# Altium schematic sheet T-Type_Board.SchDoc: <Document>
size Letter; Engineer: <Engineer>; Organization: UPEL; Address1: USU Power Electronics Lab; Address2: USTAR Building 620, RM 118; Address3: 1600 N 620 E; Address4: North Logan, UT 84341; DocumentNumber: 10; Revision: v1; SheetNumber: 10; SheetTotal: 16; ProjectName: <Project>
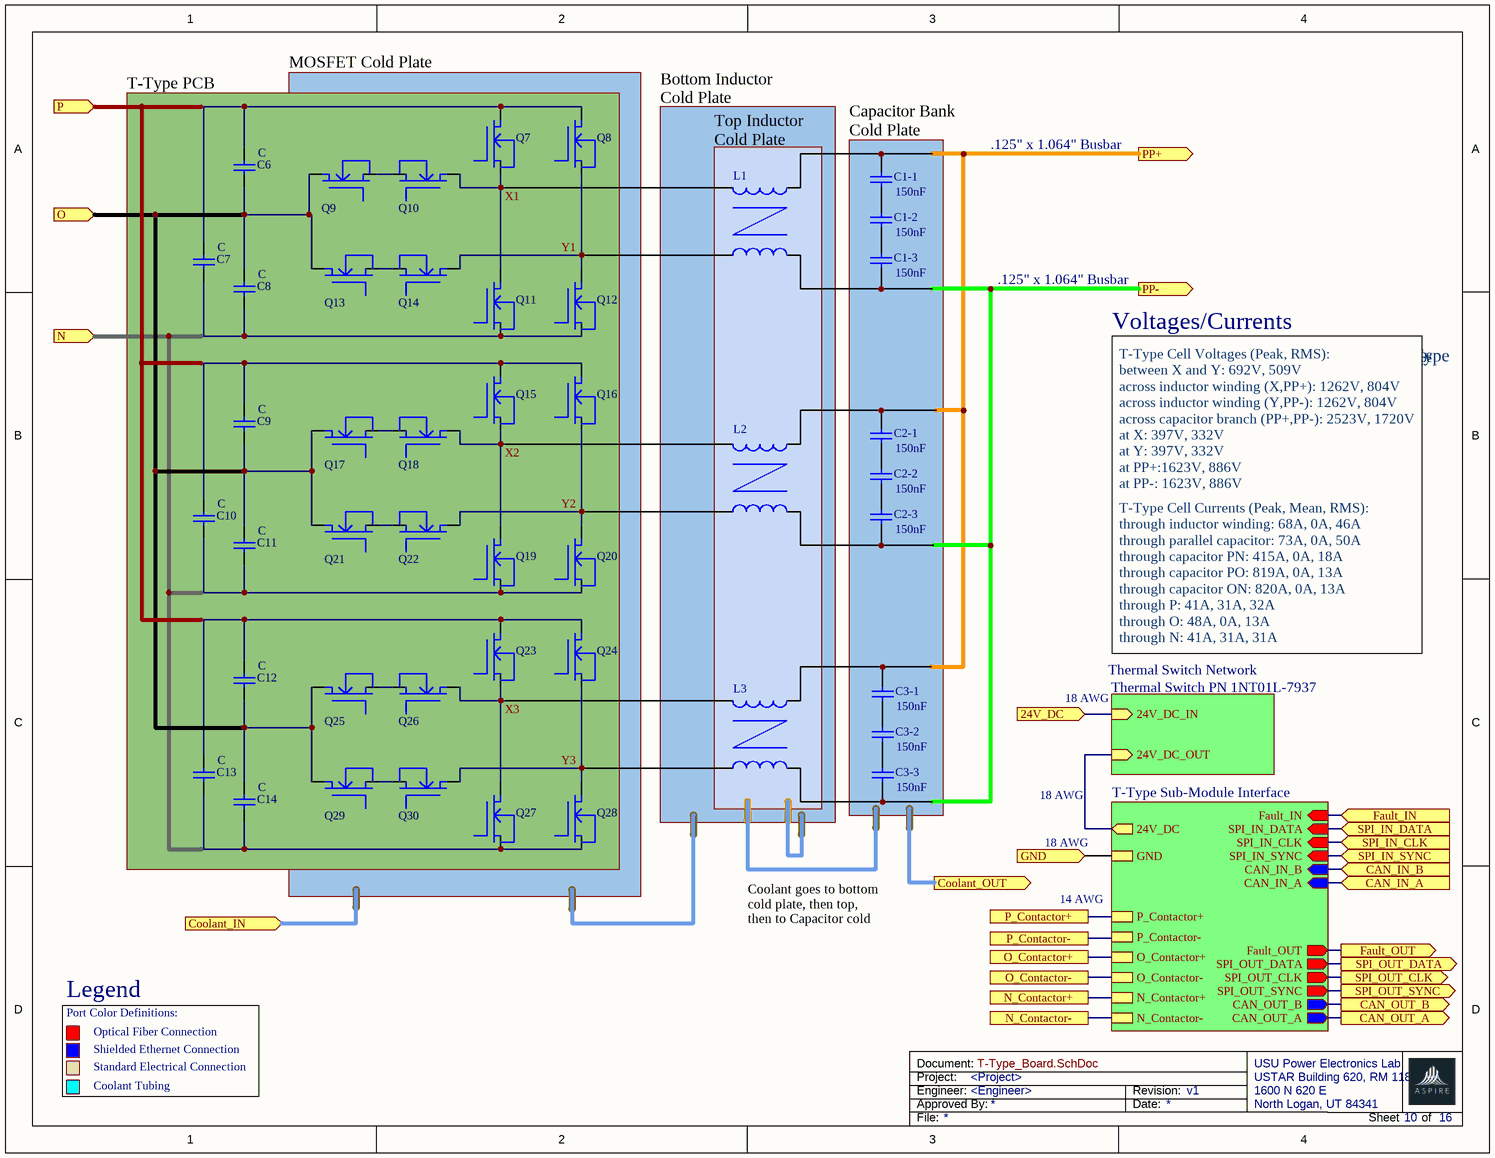
[diagram p0: T-Type_Board.SchDoc]

## Parts
(Parts that share a designator on the sheet are numbered #1, #2 ... from top to bottom, then left to right.)
C1-1  value 150nF  [RAD-0.3]  (hidden comment: Cap)
C1-2  value 150nF  [RAD-0.3]  (hidden comment: Cap)
C1-3  value 150nF  [RAD-0.3]  (hidden comment: Cap)
C2-1  value 150nF  [RAD-0.3]  (hidden comment: Cap)
C2-2  value 150nF  [RAD-0.3]  (hidden comment: Cap)
C2-3  value 150nF  [RAD-0.3]  (hidden comment: Cap)
C3-1  value 150nF  [RAD-0.3]  (hidden comment: Cap)
C3-2  value 150nF  [RAD-0.3]  (hidden comment: Cap)
C3-3  value 150nF  [RAD-0.3]  (hidden comment: Cap)
C6  C  [RAD-0.3]
C7  C  [RAD-0.3]
C8  C  [RAD-0.3]
C9  C  [RAD-0.3]
C10  C  [RAD-0.3]
C11  C  [RAD-0.3]
C12  C  [RAD-0.3]
C13  C  [RAD-0.3]
C14  C  [RAD-0.3]
L1  Inductor  [0402-A]  (value not drawn)
L2  Inductor  [0402-A]  (value not drawn)
L3  Inductor  [0402-A]  (value not drawn)
L?#1  Inductor  [0402-A]  (value not drawn)
L?#2  Inductor  [0402-A]  (value not drawn)
L?#3  Inductor  [0402-A]  (value not drawn)
Q7  T-Cell_component  (value not drawn)
Q8  T-Cell_component  (value not drawn)
Q9  T-Cell_component  (value not drawn)
Q10  T-Cell_component  (value not drawn)
Q11  T-Cell_component  (value not drawn)
Q12  T-Cell_component  (value not drawn)
Q13  T-Cell_component  (value not drawn)
Q14  T-Cell_component  (value not drawn)
Q15  T-Cell_component  (value not drawn)
Q16  T-Cell_component  (value not drawn)
Q17  T-Cell_component  (value not drawn)
Q18  T-Cell_component  (value not drawn)
Q19  T-Cell_component  (value not drawn)
Q20  T-Cell_component  (value not drawn)
Q21  T-Cell_component  (value not drawn)
Q22  T-Cell_component  (value not drawn)
Q23  T-Cell_component  (value not drawn)
Q24  T-Cell_component  (value not drawn)
Q25  T-Cell_component  (value not drawn)
Q26  T-Cell_component  (value not drawn)
Q27  T-Cell_component  (value not drawn)
Q28  T-Cell_component  (value not drawn)
Q29  T-Cell_component  (value not drawn)
Q30  T-Cell_component  (value not drawn)

## Blocks framed on the sheet
MOSFET Cold Plate: Q7-Q30

## Sub-sheets
T-Type Sub-Module Interface = File Name: 24V_DC (out), GND, CAN_IN_A (in), SPI_IN_SYNC (in), CAN_IN_B (in), SPI_IN_CLK (in), SPI_IN_DATA (in), Fault_IN (in), CAN_OUT_A (out), SPI_OUT_SYNC (out), Fault_OUT (out), CAN_OUT_B (out), SPI_OUT_CLK (out), SPI_OUT_DATA (out), P_Contactor+, P_Contactor-, O_Contactor+, O_Contactor-, N_Contactor+, N_Contactor-
Thermal Switch Network = File Name: 24V_DC_IN (in), 24V_DC_OUT (in)

## Ports
24V_DC (in), CAN_IN_A (in), CAN_IN_B (in), CAN_OUT_A (out), CAN_OUT_B (out), Coolant_IN (in), Coolant_OUT (out), Fault_IN (in), Fault_OUT (out), GND (in), N (in), N_Contactor+, N_Contactor-, O (in), O_Contactor+, O_Contactor-, P (in), P_Contactor+, P_Contactor-, PP+ (out), PP- (out), SPI_IN_CLK (in), SPI_IN_DATA (in), SPI_IN_SYNC (in), SPI_OUT_CLK (out), SPI_OUT_DATA (out), SPI_OUT_SYNC (out)

## Nets
24V_DC: port 24V_DC, sheet Thermal Switch Network/24V_DC_IN
CAN_IN_A: port CAN_IN_A, sheet T-Type Sub-Module Interface/CAN_IN_A
CAN_IN_B: port CAN_IN_B, sheet T-Type Sub-Module Interface/CAN_IN_B
CAN_OUT_A: port CAN_OUT_A, sheet T-Type Sub-Module Interface/CAN_OUT_A
CAN_OUT_B: port CAN_OUT_B, sheet T-Type Sub-Module Interface/CAN_OUT_B
Fault_IN: port Fault_IN, sheet T-Type Sub-Module Interface/Fault_IN
Fault_OUT: port Fault_OUT, sheet T-Type Sub-Module Interface/Fault_OUT
GND: port GND, sheet T-Type Sub-Module Interface/GND
N_Contactor+: port N_Contactor+, sheet T-Type Sub-Module Interface/N_Contactor+
N_Contactor-: port N_Contactor-, sheet T-Type Sub-Module Interface/N_Contactor-
O: C9.1 C11.2 Q17.4 Q21.4 ; port O
O_Contactor+: port O_Contactor+, sheet T-Type Sub-Module Interface/O_Contactor+
O_Contactor-: port O_Contactor-, sheet T-Type Sub-Module Interface/O_Contactor-
P_Contactor+: port P_Contactor+, sheet T-Type Sub-Module Interface/P_Contactor+
PP+: C1-1.2 C2-1.2 C3-1.2 L1.1 L2.1 L3.1 ; port PP+
PP-: C1-3.1 C2-3.1 C3-3.1 L?#1.2 L?#2.2 L?#3.2 ; port PP-
SPI_IN_CLK: port SPI_IN_CLK, sheet T-Type Sub-Module Interface/SPI_IN_CLK
SPI_IN_DATA: port SPI_IN_DATA, sheet T-Type Sub-Module Interface/SPI_IN_DATA
SPI_IN_SYNC: port SPI_IN_SYNC, sheet T-Type Sub-Module Interface/SPI_IN_SYNC
SPI_OUT_CLK: port SPI_OUT_CLK, sheet T-Type Sub-Module Interface/SPI_OUT_CLK
SPI_OUT_DATA: port SPI_OUT_DATA, sheet T-Type Sub-Module Interface/SPI_OUT_DATA
SPI_OUT_SYNC: port SPI_OUT_SYNC, sheet T-Type Sub-Module Interface/SPI_OUT_SYNC
X1: L1.2 Q7.5 Q10.4 Q11.4
X2: L2.2 Q15.5 Q18.4 Q19.4
X3: L3.2 Q23.5 Q26.4 Q27.4
Y1: L?#1.1 Q8.5 Q12.4 Q14.4
Y2: L?#2.1 Q16.5 Q20.4 Q22.4
Y3: L?#3.1 Q24.5 Q28.4 Q30.4
NetC1-1_1: C1-1.1 C1-2.2
NetC1-2_1: C1-2.1 C1-3.2
NetC2-1_1: C2-1.1 C2-2.2
NetC2-2_1: C2-2.1 C2-3.2
NetC3-1_1: C3-1.1 C3-2.2
NetC3-2_1: C3-2.1 C3-3.2
NetC6_1: C6.1 C8.2 Q9.4 Q13.4
NetC6_2: C6.2 C7.2 Q7.4 Q8.4
NetC7_1: C7.1 C8.1 Q11.5 Q12.5
NetC9_2: C9.2 C10.2 Q15.4 Q16.4
NetC10_1: C10.1 C11.1 Q19.5 Q20.5
NetC12_1: C12.1 C14.2 Q25.4 Q29.4
NetC12_2: C12.2 C13.2 Q23.4 Q24.4
NetC13_1: C13.1 C14.1 Q27.5 Q28.5
NetQ9_5: Q9.5 Q10.5
NetQ13_5: Q13.5 Q14.5
NetQ17_5: Q17.5 Q18.5
NetQ21_5: Q21.5 Q22.5
NetQ25_5: Q25.5 Q26.5
NetQ29_5: Q29.5 Q30.5
(unnamed): sheet T-Type Sub-Module Interface/24V_DC, sheet Thermal Switch Network/24V_DC_OUT

## Notes on the sheet
- T-Type PCB
- Bottom Inductor Cold Plate
- Top Inductor Cold Plate
- (near C1-1) Capacitor Bank Cold Plate
- .125" x 1.064" Busbar
- Voltages/Currents
- T-Type Cell RMS Voltages:
  between X and Y: 510V
  across inductor winding (X,PP+): 803V
  across inductor winding (Y,PP-): 803V
  across capacitor branch (PP+,PP-): 1720V
  at X: 330V
  at Y: 330V
  at PP+: 890V
  at PP-: 890V
- T-Type Cell RMS Currents:
  through inductor winding: 47A
  through parallel capacitor: 50A
  through P: 32A
  through N: 31A
  through capacitor PN: 17.7A
  through capacitor PO: 13A
  through capacitor ON: 13A
- T-Type Cell Mean Currents:
  through P: 31A
  through N: 31A
- T-Type Cell Max Voltages:
  between X and Y: 692V
  across inductor winding (X,PP+): 1261V
  across inductor winding (Y,PP-): 1261V
  across capacitor branch (PP+,PP-): 2523V
  at X: 397V
  at Y: 397V
  at PP+:1620V
  at PP-: 1620V
- T-Type Cell MAX Currents:
  through inductor winding: 69A
  through parallel capacitor: 73A
  through P: 41A
  through N: 41A
- T-Type Cell Voltages (Peak, RMS):
  between X and Y: 692V, 509V
  across inductor winding (X,PP+): 1262V, 804V
  across inductor winding (Y,PP-): 1262V, 804V
  across capacitor branch (PP+,PP-): 2523V, 1720V
  at X: 397V, 332V
  at Y: 397V, 332V
  at PP+:1623V, 886V
  at PP-: 1623V, 886V
- T-Type Cell Currents (Peak, Mean, RMS):
  through inductor winding: 68A, 0A, 46A
  through parallel capacitor: 73A, 0A, 50A
  through capacitor PN: 415A, 0A, 18A
  through capacitor PO: 819A, 0A, 13A
  through capacitor ON: 820A, 0A, 13A
  through P: 41A, 31A, 32A
  through O: 48A, 0A, 13A
  through N: 41A, 31A, 31A
- 18 AWG
- Thermal Switch PN 1NT01L-7937
- 14 AWG
- Coolant goes to bottom cold plate, then top, then to Capacitor cold plate
- Legend
- Port Color Definitions:
- Optical Fiber Connection
- Shielded Ethernet Connection
- Standard Electrical Connection
- Coolant Tubing
- Project:
- Engineer:
- Document:
- Approved By:
- Date:
- Revision:
- File:
- Sheet
- of

## Library data of the parts
C1-1-C1-3 C2-1-C2-3 C3-1-C3-3 = Cap: Capacitor; Published: 8-Jun-2000; LatestRevisionDate: 17-Jul-2002; LatestRevisionNote: Re-released for DXP Platform.; PackageReference: RAD-0.3; Publisher: Altium Limited; PackageDescription: Radial Cap, Thru-Hole; 2 Leads; 0.3 in Pin Spacing
C6-C14 = Cap: Capacitor; Value: 100pF; Published: 8-Jun-2000; LatestRevisionDate: 17-Jul-2002; LatestRevisionNote: Re-released for DXP Platform.; PackageReference: RAD-0.3; Publisher: Altium Limited; PackageDescription: Radial Cap, Thru-Hole; 2 Leads; 0.3 in Pin Spacing
L1-L3 L?#1-L?#3 = Inductor: Code_IEC: 1005; Value: 10mH; Published: 8-Jun-2000; LatestRevisionDate: 29-May-2009; LatestRevisionNote: IPC-7351 Footprint Added.; PackageReference: 0402-A; Publisher: Altium Limited; PackageDescription: Chip Inductor; Code_JEITA: 0402